# Altium schematic sheet Sheet.SchDoc: Switcher
size A4; DocumentNumber: 1; SheetNumber: 1; SheetTotal: 1
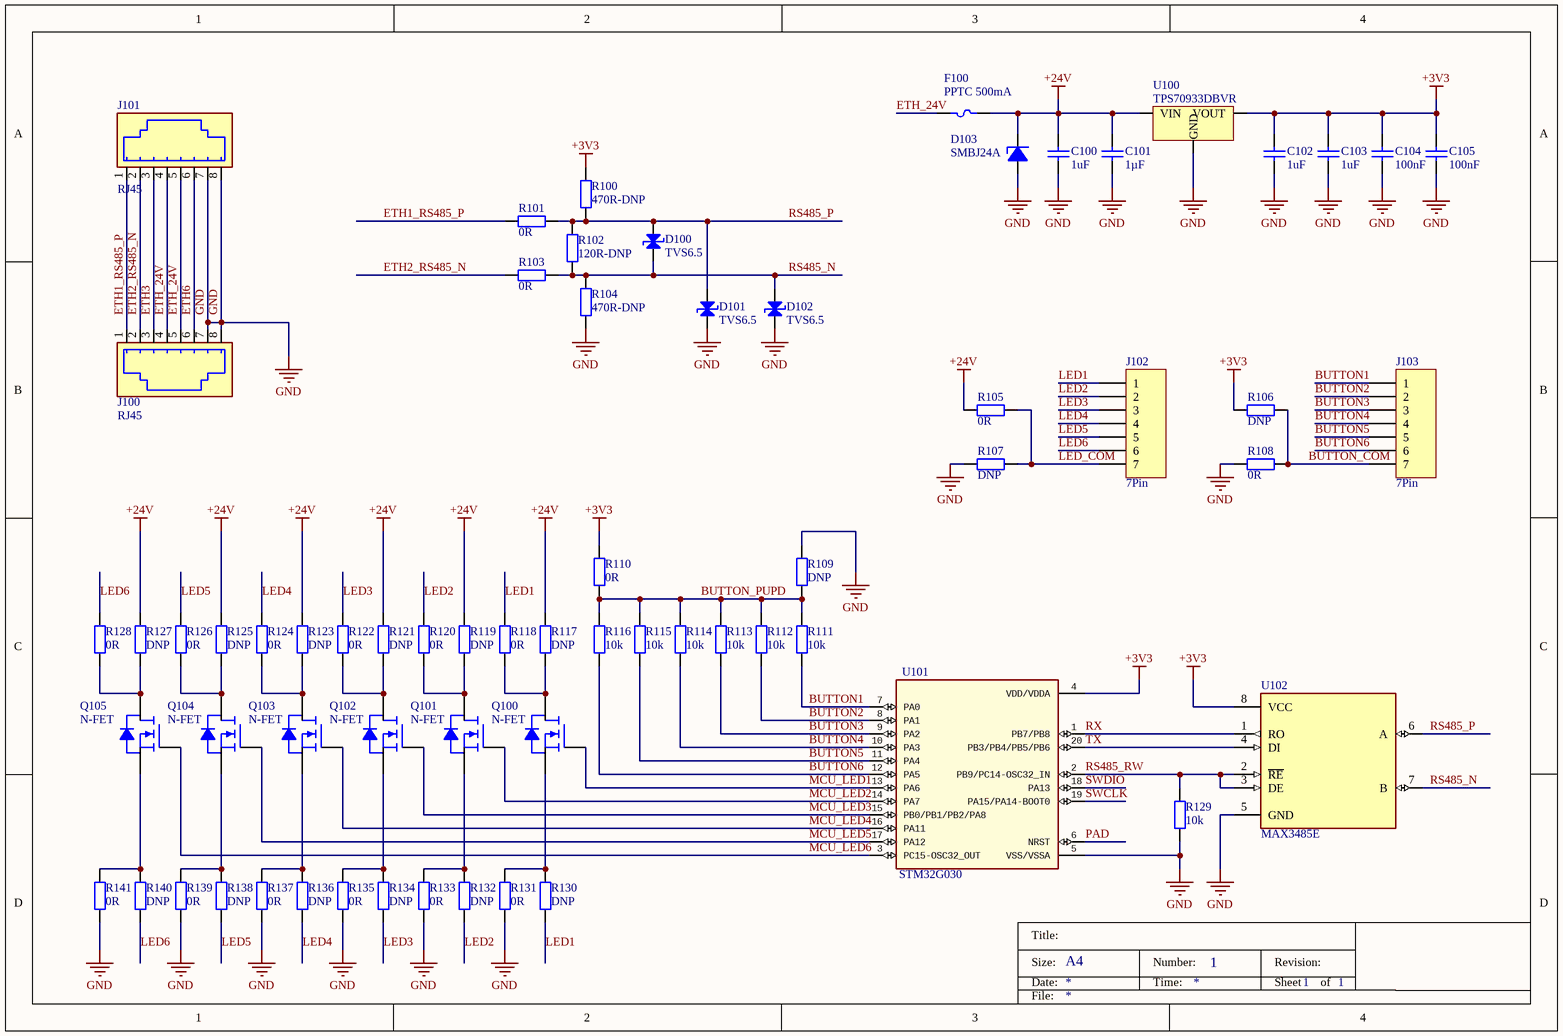
[diagram p0: Sheet.SchDoc]

## Parts
C100  1uF  [C0603]
C101  1µF  [C0603]
C102  1uF  [C0603]
C103  1uF  [C0603]
C104  100nF  [C0603]
C105  100nF  [C0603]
D100  TVS6.5  [SOD323]
D101  TVS6.5  [SOD323]
D102  TVS6.5  [SOD323]
D103  SMBJ24A  [SMB]
F100  PPTC 500mA  [PPTC1812]
J100  RJ45  [RJ45_RA]
J101  RJ45  [RJ45_RA]
J102  7Pin  [7Pin]
J103  7Pin  [7Pin]
Q100  N-FET  [SOT323]
Q101  N-FET  [SOT323]
Q102  N-FET  [SOT323]
Q103  N-FET  [SOT323]
Q104  N-FET  [SOT323]
Q105  N-FET  [SOT323]
R100  470R-DNP  [R0603]
R101  0R  [R0603]
R102  120R-DNP  [R0603]
R103  0R  [R0603]
R104  470R-DNP  [R0603]
R105  0R  [R0603]
R106  DNP  [R0603]
R107  DNP  [R0603]
R108  0R  [R0603]
R109  DNP  [R0603]
R110  0R  [R0603]
R111  10k  [R0603]
R112  10k  [R0603]
R113  10k  [R0603]
R114  10k  [R0603]
R115  10k  [R0603]
R116  10k  [R0603]
R117  DNP  [R0603]
R118  0R  [R0603]
R119  DNP  [R0603]
R120  0R  [R0603]
R121  DNP  [R0603]
R122  0R  [R0603]
R123  DNP  [R0603]
R124  0R  [R0603]
R125  DNP  [R0603]
R126  0R  [R0603]
R127  DNP  [R0603]
R128  0R  [R0603]
R129  10k  [R0603]
R130  DNP  [R0603]
R131  0R  [R0603]
R132  DNP  [R0603]
R133  0R  [R0603]
R134  DNP  [R0603]
R135  0R  [R0603]
R136  DNP  [R0603]
R137  0R  [R0603]
R138  DNP  [R0603]
R139  0R  [R0603]
R140  DNP  [R0603]
R141  0R  [R0603]
U100  TPS70933DBVR  [SOT-23-5]
U101  STM32G030  [TSSOP20]
U102  MAX3485E  [SOIC-08]

## Nets
+3V3: C102.2 C103.2 C104.2 C105.2 R100.2 R106.2 R110.2 U100.5(VOUT) U101.4(VDD/VDDA) U102.8(VCC)
+24V: C100.2 C101.2 D103.1 F100.2 R105.2 R117.2 R119.2 R121.2 R123.2 R125.2 R127.2 U100.1(VIN)
GND: C100.1 C101.1 C102.1 C103.1 C104.1 C105.1 D101.1 D102.1 D103.2 J100.7 J100.8 J101.7 J101.8 R104.1 R107.2 R108.2 R109.2 R129.1 R131.1 R133.1 R135.1 R137.1 R139.1 R141.1 U100.2(GND) U101.5(VSS/VSSA) U102.5(GND)
BUTTON1: J103.1 R111.1 U101.7(PA0)
BUTTON2: J103.2 R112.1 U101.8(PA1)
BUTTON3: J103.3 R113.1 U101.9(PA2)
BUTTON4: J103.4 R114.1 U101.10(PA3)
BUTTON5: J103.5 R115.1 U101.11(PA4)
BUTTON6: J103.6 R116.1 U101.12(PA5)
BUTTON_COM: J103.7 R106.1 R108.1
BUTTON_PUPD: R109.1 R110.1 R111.2 R112.2 R113.2 R114.2 R115.2 R116.2
ETH1_RS485_P: J100.1 J101.1 R101.1
ETH2_RS485_N: J100.2 J101.2 R103.1
ETH3: J100.3 J101.3
ETH6: J100.6 J101.6
ETH_24V: F100.1 J100.4 J100.5 J101.4 J101.5
LED1: J102.1 R118.2 R130.1
LED2: J102.2 R120.2 R132.1
LED3: J102.3 R122.2 R134.1
LED4: J102.4 R124.2 R136.1
LED5: J102.5 R126.2 R138.1
LED6: J102.6 R128.2 R140.1
LED_COM: J102.7 R105.1 R107.1
MCU_LED1: Q100.1(G) U101.13(PA6)
MCU_LED2: Q101.1(G) U101.14(PA7)
MCU_LED3: Q102.1(G) U101.15(PB0/PB1/PB2/PA8)
MCU_LED4: Q103.1(G) U101.16(PA11)
MCU_LED5: Q104.1(G) U101.17(PA12)
MCU_LED6: Q105.1(G) U101.3(PC15-OSC32_OUT)
PAD: U101.6(NRST)
RS485_N: D100.1 D102.2 R102.1 R103.2 R104.2 U102.7(B)
RS485_P: D100.2 D101.2 R100.1 R101.2 R102.2 U102.6(A)
RS485_RW: R129.2 U101.2(PB9/PC14-OSC32_IN) U102.2(~{RE}) U102.3(DE)
RX: U101.1(PB7/PB8) U102.1(RO)
SWCLK: U101.19(PA15/PA14-BOOT0)
SWDIO: U101.18(PA13)
TX: U101.20(PB3/PB4/PB5/PB6) U102.4(DI)
NetQ100_2: Q100.2(S) R130.2 R131.2
NetQ100_3: Q100.3(D) R117.1 R118.1
NetQ101_2: Q101.2(S) R132.2 R133.2
NetQ101_3: Q101.3(D) R119.1 R120.1
NetQ102_2: Q102.2(S) R134.2 R135.2
NetQ102_3: Q102.3(D) R121.1 R122.1
NetQ103_2: Q103.2(S) R136.2 R137.2
NetQ103_3: Q103.3(D) R123.1 R124.1
NetQ104_2: Q104.2(S) R138.2 R139.2
NetQ104_3: Q104.3(D) R125.1 R126.1
NetQ105_2: Q105.2(S) R140.2 R141.2
NetQ105_3: Q105.3(D) R127.1 R128.1

## Notes on the sheet
- Title:
- Size:
- Date:
- A4
- Number:
- Time:
- Revision:
- Sheet
- of
- File:

## Library data of the parts
C100-C105 = Capacitor
D100-D102 = TVS Bi
D103 = TVS Uni
F100 = Fuse
J100 J101 = RJ45: Jack Modular Connector 8p8c (RJ45, Ethernet) Vertical Unshielded Cat5; MF: Wurth Elektronik; MP: 615008144221; Price: None; Purchase-URL: https://pricing.snapeda.com/search/part/615008144221/?ref=eda; Value: *; Package: None; Availability: In Stock
R100-R141 = Resistor
U100 = LDO: MP: LP38690DT-5.0/NOPB; MF: Texas Instruments; Availability: Warning; Package: TO-252-3 Texas Instruments; Value: *; Purchase-URL: https://pricing.snapeda.com/search/part/LP38690DT-5.0/NOPB/?ref=eda; SnapEDA_Link: https://www.snapeda.com/parts/LP38690DT-5.0/NOPB/Texas%20Instruments/view-part/25360/?ref=snap; Price: None
U101 = STM32G030: Mfr_Name: STMicroelectronics; GateName_1: A; SymbolName_1: STM32G030F6P6TR; DeviceName: TSSOP20-L; LibraryName: 2022-06-19_13-31-56_Library; DeviceSetName: STM32G030F6P6TR; Copyright: Copyright (C) 2022 Ultra Librarian. All rights reserved.; Manufacturer_Part_Number: STM32G030F6P6TR
U102 = MAX3485E: 1/1 Transceiver Half RS422, RS485 8-SOIC; MF: Maxim Integrated; MP: MAX3485EESA+T; Value: *; Package: SOIC-8 Maxim; Check_prices: https://www.snapeda.com/parts/MAX3485EESA+T/Maxim%20Integrated/view-part/574654/?ref=eda; SnapEDA_Link: https://www.snapeda.com/parts/MAX3485EESA+T/Maxim%20Integrated/view-part/574654/?ref=snap; Digi-Key_Part_Number: MAX3485EESA+TCT-ND